# Altium schematic sheet PSU.SchDoc: Power supply
size A4; Organization: BME AUT; Address1: Magyar tudósok krt. 2.; Address2: Q épület; Address3: Budapest; Address4: H-1117; DocumentNumber: 1; Revision: 1.0; SheetNumber: 2; SheetTotal: 3
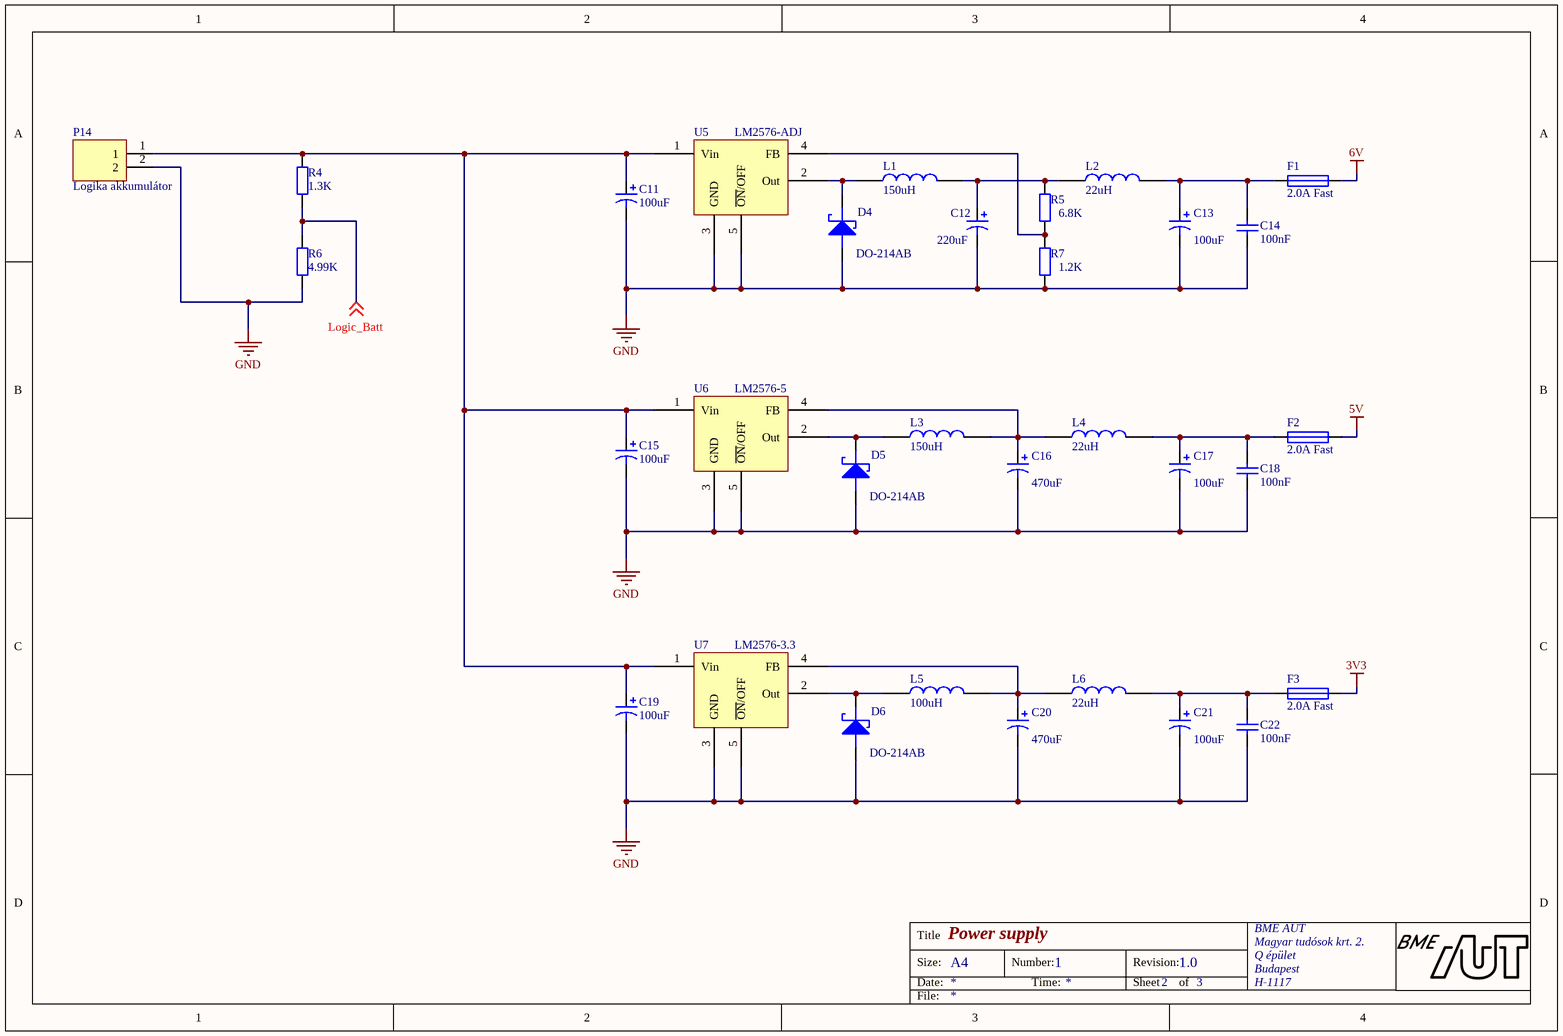
[diagram p0: PSU.SchDoc]

## Parts
C11  100uF  [FP_CAP_ELKO_6,3X6,3]
C12  220uF  [FP_CAP_ELKO_6,3X6,3]
C13  100uF  [FP_CAP_ELKO_6,3X6,3]
C14  100nF  [FP_0805_CAP_085]
C15  100uF  [FP_CAP_ELKO_6,3X6,3]
C16  470uF  [FP_CAP_ELKO_6,3X6,3]
C17  100uF  [FP_CAP_ELKO_6,3X6,3]
C18  100nF  [FP_0805_CAP_085]
C19  100uF  [FP_CAP_ELKO_6,3X6,3]
C20  470uF  [FP_CAP_ELKO_6,3X6,3]
C21  100uF  [FP_CAP_ELKO_6,3X6,3]
C22  100nF  [FP_0805_CAP_085]
D4  DO-214AB  [FP_SMC]
D5  DO-214AB  [FP_SMC]
D6  DO-214AB  [FP_SMC]
F1  2.0A Fast  [FP_0805_RES]
F2  2.0A Fast  [FP_0805_RES]
F3  2.0A Fast  [FP_0805_RES]
L1  150uH  [FP_IND_12.3x12.3]
L2  22uH  [FP_IND_10x10]
L3  150uH  [FP_IND_12.3x12.3]
L4  22uH  [FP_IND_10x10]
L5  100uH  [FP_IND_12.5x12.5]
L6  22uH  [FP_IND_10x10]
P14  Logika akkumulátor  [FP_XT60]
R4  1.3K  [FP_0805_RES]
R5  6.8K  [FP_0805_RES]
R6  4.99K  [FP_0805_RES]
R7  1.2K  [FP_0805_RES]
U5  LM2576-ADJ  [FP_TO220-5]
U6  LM2576-5  [FP_TO220-5]
U7  LM2576-3.3  [FP_TO220-5]

## Nets
3V3: F3.2
5V: F2.2
6V: F1.2
GND: C11.N C12.N C13.N C14.1 C15.N C16.N C17.N C18.1 C19.N C20.N C21.N C22.1 D4.2(ANODE) D5.2(ANODE) D6.2(ANODE) P14.2 R6.1 R7.1 U5.3(GND) U5.5(~{ON}/OFF) U6.3(GND) U6.5(~{ON}/OFF) U7.3(GND) U7.5(~{ON}/OFF)
Logic_Batt: R4.1 R6.2 ; off-sheet Logic_Batt
NetC11_P: C11.P C15.P C19.P P14.1 R4.2 U5.1(Vin) U6.1(Vin) U7.1(Vin)
NetC12_P: C12.P L1.2 L2.1 R5.2
NetC13_P: C13.P C14.2 F1.1 L2.2
NetC16_P: C16.P L3.2 L4.1 U6.4(FB)
NetC17_P: C17.P C18.2 F2.1 L4.2
NetC20_P: C20.P L5.2 L6.1 U7.4(FB)
NetC21_P: C21.P C22.2 F3.1 L6.2
NetD4_1: D4.1(CATHODE) L1.1 U5.2(Out)
NetD5_1: D5.1(CATHODE) L3.1 U6.2(Out)
NetD6_1: D6.1(CATHODE) L5.1 U7.2(Out)
NetR5_1: R5.1 R7.2 U5.4(FB)

## Notes on the sheet
- Title
- Size:
- Date:
- A4
- Number:
- Time:
- Revision:
- Sheet
- of
- File:

## Library data of the parts
C11 C13 C15 C17 C19 C21 = CAP_ELECT: Polarized Capacitor; Voltage: 16V; Tolerance: 20%; Name: VSV107M016S0ANE010; Supplier: Lomex; Reference: 91-00-20; Value: 100uF
C12 = CAP_ELECT: Polarized Capacitor; Voltage: 16V; Tolerance: 20%; Name: VEV227M016S0ANE040; Supplier: Lomex; Reference: 91-00-92; Value: 220uF
C14 C18 C22 = CAP: Capacitor; Tolerance: 10%; Voltage: 50V; Name: 0805B104K500CT; Supplier: Lomex; Reference: 82-10-76; Value: 100nF
C16 C20 = CAP_ELECT: Polarized Capacitor; Voltage: 16V; Tolerance: 20%; Reference: 2612034; Name: EEETC1C101XP; Supplier: Farnell; Value: 470uF
D4-D6 = SCHOTTKY: Schottky diode; Reference: 2675142; Name: SS32+; Supplier: Farnell
F1-F3 = Fuse: Reference: 1337421; Name: MCF0805B2R00FSTR; Supplier: Farnell
L1 L3 = IND: Inductor; Imax: 1.8A; Tolerance: 10%; Reference: 2288481; Name: MSS1278-154KLD; Supplier: Farnell; Value: 150uH
L2 L4 L6 = IND: Inductor; Imax: 2.5A; Tolerance: 20%; Reference: 2360369; Name: ELLATP220MB; Supplier: Farnell; Value: 22uH
L5 = IND: Inductor; Imax: 2.1A; Tolerance: 20%; Reference: 2374166; Name: SRR1280A-101M; Supplier: Farnell; Value: 100uH
P14 = Connector_2pin: 2pin connector; Name: XT60; Supplier: külső
R4 = RES: Resistor; Tolerance: 1%; Power: 1/8W; Name: CR-05FL7---1K3; Supplier: Lomex; Reference: 80-11-95; Value: 1.3K
R5 = RES: Resistor; Tolerance: 1%; Power: 1/8W; Name: CR-05FL7---6K8; Supplier: Lomex; Reference: 80-10-96; Value: 6.8K
R6 = RES: Resistor; Tolerance: 1%; Power: 1/8W; Name: WR08X4991FTL; Supplier: Lomex; Reference: 80-37-34; Value: 4.99K
R7 = RES: Resistor; Tolerance: 1%; Power: 1/8W; Name: CR-05FL7---1K2; Supplier: Lomex; Reference: 80-10-87; Value: 1.2K
U5 = LM2576: 3-A Step-Down Voltage Regulator; Reference: 9488146; Name: LM2576-ADJ; Supplier: Farnell
U6 = LM2576: 3-A Step-Down Voltage Regulator; Name: LM2576-5.0; Reference: 1564682; Supplier: Farnell
U7 = LM2576: 3-A Step-Down Voltage Regulator; Reference: 2382916; Name: LM2576-3.3; Supplier: Farnell